# EAGLE schematic MKR1010_Barometer (EAGLE 9.2.2)
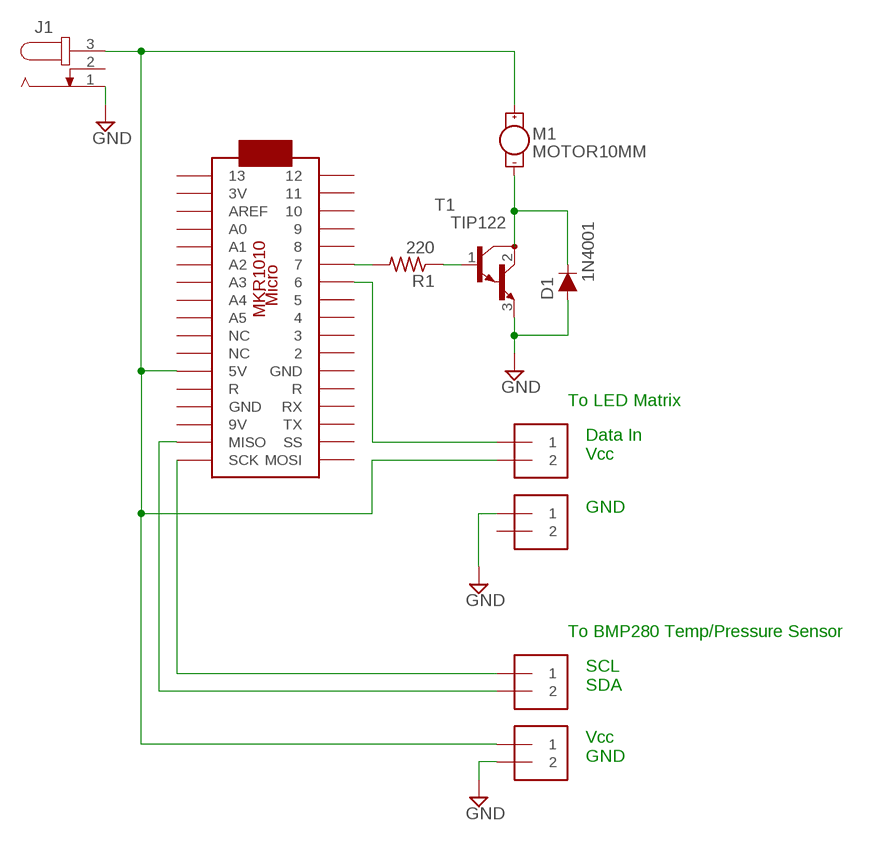
[diagram p0: schematic, sheet 1]

## Parts
D1  1N4001  DIODE-PTH  [DIODE-1N4001]
J1  JACK-PLUG0  [SPC4077]
J2  1X2-3.5MM  [1X2-3.5MM]
J3  1X2-3.5MM  [1X2-3.5MM]
J4  1X2-3.5MM  [1X2-3.5MM]
J5  1X2-3.5MM  [1X2-3.5MM]
M1  MOTOR10MM  [VIBE-MOTOR-10MM]
MKR1010  ARDUINOMICRO  [ARDUINOMICRO]
R1  220  R-US_0207/12  [0207/12]
T1  TIP122  [TO220]

## Nets
GND: D1.A J1.1 J3.1 J5.2 T1.3(E)
N$1: MKR1010.P$6 R1.2
N$2: R1.1 T1.1(B)
N$3: D1.C M1.- T1.2(C)
N$4: J1.3 J2.2 J5.1 M1.+ MKR1010.P$23(5V)
N$5: J2.1 MKR1010.P$7
N$6: J4.1 MKR1010.P$18(SCK)
N$7: J4.2 MKR1010.P$19(MISO)
Unconnected: J1.2 J3.2 MKR1010.P$1 MKR1010.P$2 MKR1010.P$3 MKR1010.P$4 MKR1010.P$5 MKR1010.P$8 MKR1010.P$9 MKR1010.P$10 MKR1010.P$11 MKR1010.P$12(GND) MKR1010.P$13(R) MKR1010.P$14(RX) MKR1010.P$15(TX) MKR1010.P$16(SS) MKR1010.P$17(MOSI) MKR1010.P$20(9V) MKR1010.P$21(GND) MKR1010.P$22(R) MKR1010.P$24(NC) MKR1010.P$25(NC) MKR1010.P$26(A5) MKR1010.P$27(A4) MKR1010.P$28(A3) MKR1010.P$29(A2) MKR1010.P$30(A1) MKR1010.P$31(A0) MKR1010.P$32(AREF) MKR1010.P$33(3V) MKR1010.P$34

## Notes on the sheet
- MKR1010
- To LED Matrix
- Data In
  Vcc
- GND
- To BMP280 Temp/Pressure Sensor
- SCL
  SDA
- Vcc
  GND

## Library data of the parts
D1 = SparkFun-DiscreteSemi:DIODE: Diode These are standard reverse protection diodes and small signal diodes. SparkFun Products: SparkFun SparkPunk Sound Kit <https://www.sparkfun.com/products/11177> SparkFun ESP8266 Thing <https://www.sparkfun.com/products/13231>; PROD_ID: DIO-09176; VALUE: 1A/50V/1.1V
J1 = con-jack:JACK-PLUG: DC POWER JACK Power Jack, DC, Right Angle, Through Hole, Rated 5A at 16VDC, PC Terminals Distributor: Farnell (www.Farnell.de) Drawing: 84N1161.pdf / 84N1162.pdf Manufacturer: SPC Technology (www.spctechnology.com) Type: SPC4077 / SPC 4078; OC_FARNELL: unknown; OC_NEWARK: unknown
J2-J5 = adafruit:1X2: 3.5mm Terminal block http://www.ladyada.net/library/pcb/eaglelibrary.html
M1 = SparkFun-Electromechanical:MOTOR: Motor (Single-Phase) Two-terminal, single-phase motors. SparkFun Products Vibration Motor <https://www.sparkfun.com/products/8449> (ROB-08449) Physical dimension and wire connections for this powerful vibration motor. Motor has a self adhesive backing.; PROD_ID: COMP-08572; SF_SKU: ROB-08449
MKR1010 = adafruit:ARDUINOMICRO
R1 = adafruit:R-US_: RESISTOR, American symbol
T1 = transistor:TIP122: NPN BIPOLAR DARLINGTON TRANSISTOR